# EAGLE schematic AMS Enerdel Adapter rev9 (EAGLE 9.6.2)
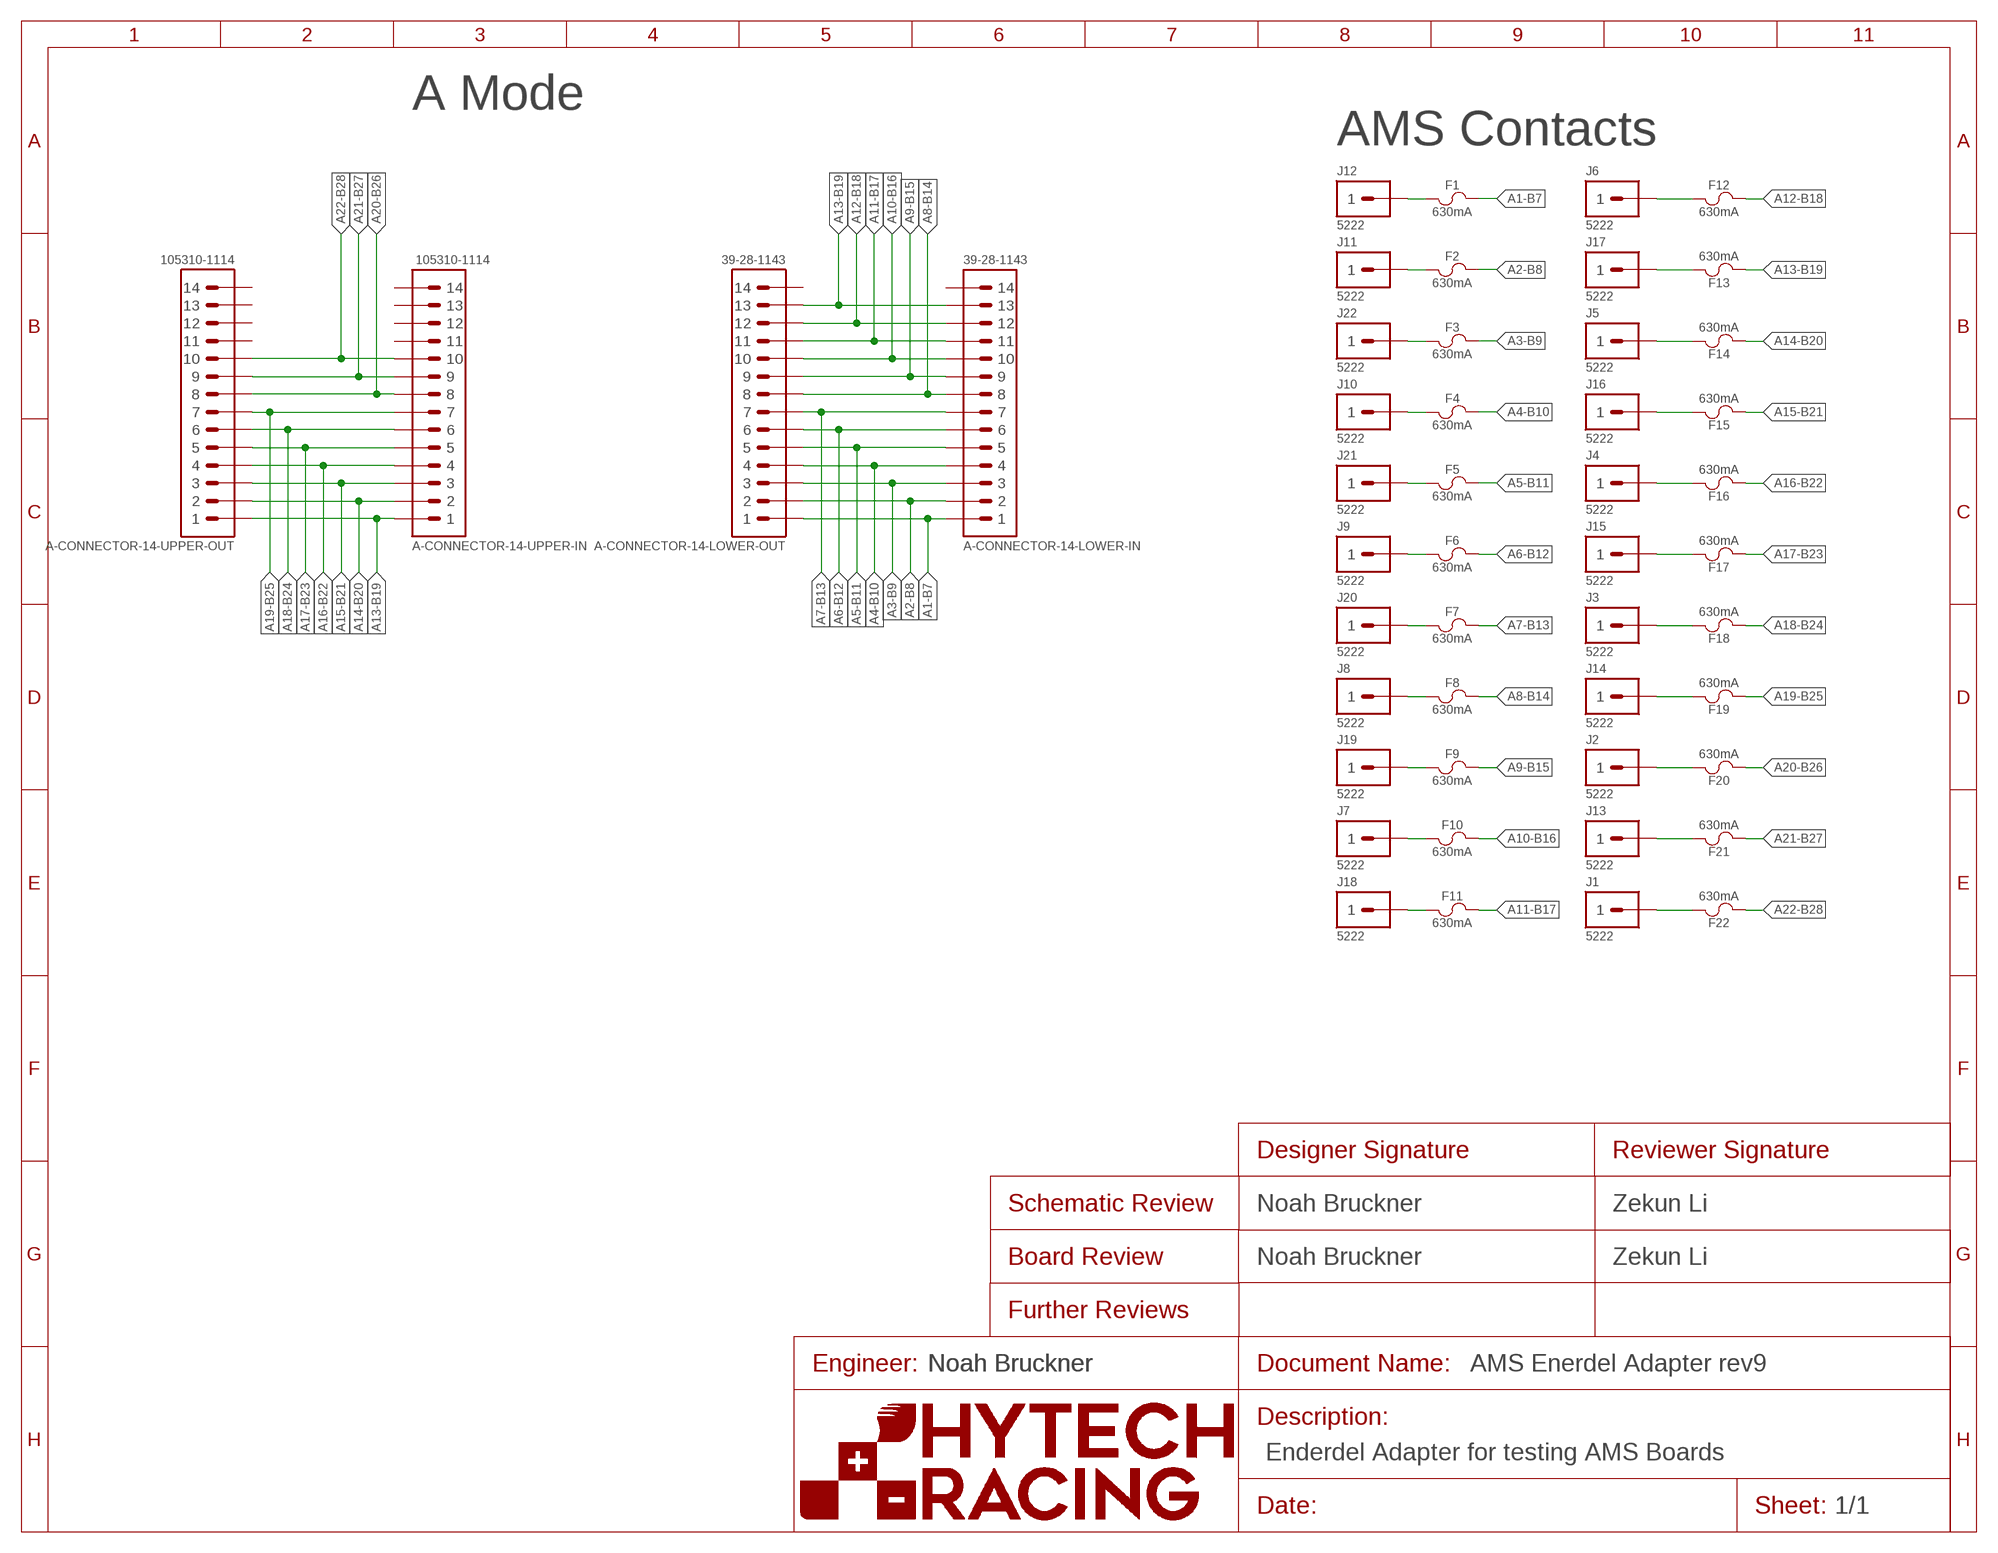
[diagram p0: schematic, sheet 1]
FRAME1 (FRAME): DESIGNER_BOARD: Noah Bruckner; DESIGNER_SCHEMATIC: Noah Bruckner; ENGINEER: Noah Bruckner; REVIEWER_BOARD: Zekun Li; REVIEWER_SCHEMATIC: Zekun Li

## Parts
A-CONNECTOR-14-LOWER-IN  CONNECTOR-14_MINIFIT_  [MOLEX_MINIFIT_PTH_14]
A-CONNECTOR-14-LOWER-OUT  CONNECTOR-14_MINIFIT_  [MOLEX_MINIFIT_PTH_14]
A-CONNECTOR-14-UPPER-IN  CONNECTOR-14_NANOFIT_  [MOLEX_NANOFIT_PTH_14]
A-CONNECTOR-14-UPPER-OUT  CONNECTOR-14_NANOFIT_  [MOLEX_NANOFIT_PTH_14]
F1  FUSE_OMF_125_.63A  [OMF_125]
F2  FUSE_OMF_125_.63A  [OMF_125]
F3  FUSE_OMF_125_.63A  [OMF_125]
F4  FUSE_OMF_125_.63A  [OMF_125]
F5  FUSE_OMF_125_.63A  [OMF_125]
F6  FUSE_OMF_125_.63A  [OMF_125]
F7  FUSE_OMF_125_.63A  [OMF_125]
F8  FUSE_OMF_125_.63A  [OMF_125]
F9  FUSE_OMF_125_.63A  [OMF_125]
F10  FUSE_OMF_125_.63A  [OMF_125]
F11  FUSE_OMF_125_.63A  [OMF_125]
F12  FUSE_OMF_125_.63A  [OMF_125]
F13  FUSE_OMF_125_.63A  [OMF_125]
F14  FUSE_OMF_125_.63A  [OMF_125]
F15  FUSE_OMF_125_.63A  [OMF_125]
F16  FUSE_OMF_125_.63A  [OMF_125]
F17  FUSE_OMF_125_.63A  [OMF_125]
F18  FUSE_OMF_125_.63A  [OMF_125]
F19  FUSE_OMF_125_.63A  [OMF_125]
F20  FUSE_OMF_125_.63A  [OMF_125]
F21  FUSE_OMF_125_.63A  [OMF_125]
F22  FUSE_OMF_125_.63A  [OMF_125]
J1  CONNECTOR-1_5222  [5222]
J2  CONNECTOR-1_5222  [5222]
J3  CONNECTOR-1_5222  [5222]
J4  CONNECTOR-1_5222  [5222]
J5  CONNECTOR-1_5222  [5222]
J6  CONNECTOR-1_5222  [5222]
J7  CONNECTOR-1_5222  [5222]
J8  CONNECTOR-1_5222  [5222]
J9  CONNECTOR-1_5222  [5222]
J10  CONNECTOR-1_5222  [5222]
J11  CONNECTOR-1_5222  [5222]
J12  CONNECTOR-1_5222  [5222]
J13  CONNECTOR-1_5222  [5222]
J14  CONNECTOR-1_5222  [5222]
J15  CONNECTOR-1_5222  [5222]
J16  CONNECTOR-1_5222  [5222]
J17  CONNECTOR-1_5222  [5222]
J18  CONNECTOR-1_5222  [5222]
J19  CONNECTOR-1_5222  [5222]
J20  CONNECTOR-1_5222  [5222]
J21  CONNECTOR-1_5222  [5222]
J22  CONNECTOR-1_5222  [5222]

## Nets
A1-B7: A-CONNECTOR-14-LOWER-IN.1 A-CONNECTOR-14-LOWER-OUT.1 F1.2
A2-B8: A-CONNECTOR-14-LOWER-IN.2 A-CONNECTOR-14-LOWER-OUT.2 F2.2
A3-B9: A-CONNECTOR-14-LOWER-IN.3 A-CONNECTOR-14-LOWER-OUT.3 F3.2
A4-B10: A-CONNECTOR-14-LOWER-IN.4 A-CONNECTOR-14-LOWER-OUT.4 F4.2
A5-B11: A-CONNECTOR-14-LOWER-IN.5 A-CONNECTOR-14-LOWER-OUT.5 F5.2
A6-B12: A-CONNECTOR-14-LOWER-IN.6 A-CONNECTOR-14-LOWER-OUT.6 F6.2
A7-B13: A-CONNECTOR-14-LOWER-IN.7 A-CONNECTOR-14-LOWER-OUT.7 F7.2
A8-B14: A-CONNECTOR-14-LOWER-IN.8 A-CONNECTOR-14-LOWER-OUT.8 F8.2
A9-B15: A-CONNECTOR-14-LOWER-IN.9 A-CONNECTOR-14-LOWER-OUT.9 F9.2
A10-B16: A-CONNECTOR-14-LOWER-IN.10 A-CONNECTOR-14-LOWER-OUT.10 F10.2
A11-B17: A-CONNECTOR-14-LOWER-IN.11 A-CONNECTOR-14-LOWER-OUT.11 F11.2
A12-B18: A-CONNECTOR-14-LOWER-IN.12 A-CONNECTOR-14-LOWER-OUT.12 F12.2
A13-B19: A-CONNECTOR-14-LOWER-IN.13 A-CONNECTOR-14-LOWER-OUT.13 A-CONNECTOR-14-UPPER-IN.1 A-CONNECTOR-14-UPPER-OUT.1 F13.1
A14-B20: A-CONNECTOR-14-UPPER-IN.2 A-CONNECTOR-14-UPPER-OUT.2 F14.1
A15-B21: A-CONNECTOR-14-UPPER-IN.3 A-CONNECTOR-14-UPPER-OUT.3 F15.1
A16-B22: A-CONNECTOR-14-UPPER-IN.4 A-CONNECTOR-14-UPPER-OUT.4 F16.1
A17-B23: A-CONNECTOR-14-UPPER-IN.5 A-CONNECTOR-14-UPPER-OUT.5 F17.1
A18-B24: A-CONNECTOR-14-UPPER-IN.6 A-CONNECTOR-14-UPPER-OUT.6 F18.1
A19-B25: A-CONNECTOR-14-UPPER-IN.7 A-CONNECTOR-14-UPPER-OUT.7 F19.1
A20-B26: A-CONNECTOR-14-UPPER-IN.8 A-CONNECTOR-14-UPPER-OUT.8 F20.1
A21-B27: A-CONNECTOR-14-UPPER-IN.9 A-CONNECTOR-14-UPPER-OUT.9 F21.1
A22-B28: A-CONNECTOR-14-UPPER-IN.10 A-CONNECTOR-14-UPPER-OUT.10 F22.1
N$1: F1.1 J12.1
N$2: F2.1 J11.1
N$3: F3.1 J22.1
N$4: F4.1 J10.1
N$8: F5.1 J21.1
N$9: F6.1 J9.1
N$10: F7.1 J20.1
N$11: F8.1 J8.1
N$12: F9.1 J19.1
N$13: F10.1 J7.1
N$14: F11.1 J18.1
N$15: F22.2 J1.1
N$16: F21.2 J13.1
N$17: F20.2 J2.1
N$18: F19.2 J14.1
N$19: F18.2 J3.1
N$20: F17.2 J15.1
N$21: F16.2 J4.1
N$22: F15.2 J16.1
N$23: F14.2 J5.1
N$24: F12.1 J6.1
N$25: F13.2 J17.1
Unconnected: A-CONNECTOR-14-LOWER-IN.14 A-CONNECTOR-14-LOWER-OUT.14 A-CONNECTOR-14-UPPER-IN.11 A-CONNECTOR-14-UPPER-IN.12 A-CONNECTOR-14-UPPER-IN.13 A-CONNECTOR-14-UPPER-IN.14 A-CONNECTOR-14-UPPER-OUT.11 A-CONNECTOR-14-UPPER-OUT.12 A-CONNECTOR-14-UPPER-OUT.13 A-CONNECTOR-14-UPPER-OUT.14

## Notes on the sheet
- A Mode
- AMS Contacts
- Noah Bruckner
- Enderdel Adapter for testing AMS Boards

## Library data of the parts
A-CONNECTOR-14-LOWER-IN A-CONNECTOR-14-LOWER-OUT = HyTechDevices:CONNECTOR-14_?_*; MPN: 39-28-1143
A-CONNECTOR-14-UPPER-IN A-CONNECTOR-14-UPPER-OUT = HyTechDevices:CONNECTOR-14_?_*; MPN: 105310-1114
F1-F22 = HyTechDevices:FUSE_?_*: Fuse 885 Series <https://www.mouser.com/datasheet/2/240/Littelfuse_Fuse_885_Datasheet_pdf-1371443.pdf> MST 250 Series <https://www.mouser.com/datasheet/2/358/typ_MST_250-1772502.pdf> OMF 125 Series <https://www.mouser.com/datasheet/2/358/typ_OMF_125-1275954.pdf>; CURRENT: 630mA; DKPN: 486-2997-ND; FUSE_TYPE: SMD; I2T: 0.02; MANUFACTURER: Schurter Inc.; MOPN: 693-3404.0008.11; MPN: 3404.0008.11; VOLTAGE: 125V
J1-J22 = HyTechDevices:CONNECTOR-1_?: 1 Pin Connector Pogo pin datasheet <https://www.mouser.com/datasheet/2/273/Mill-Max_03212019_807-22-001-10-020101-1545127.pdf> 5222 Spring datasheet <https://www.mouser.com/datasheet/2/215/5222-743174.pdf>; DKPN: 36-5222-ND; MANUFACTURER: Keystone Electronics; MODEL: SPRING; MOPN: 534-5222; MPN: 5222